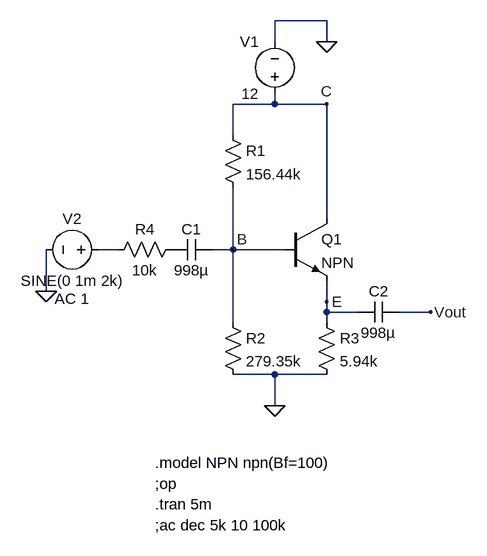
[diagram p0: schematic estagio1.asc]
estagio1.asc, the LTspice schematic file:
Version 4
SHEET 1 880 680
WIRE 224 -192 144 -192
WIRE 144 -160 144 -192
WIRE 224 -160 224 -192
WIRE 144 -64 144 -80
WIRE 144 -64 80 -64
WIRE 224 -64 144 -64
WIRE 80 -16 80 -64
WIRE 224 112 224 -64
WIRE -96 160 -128 160
WIRE 80 160 80 64
WIRE 80 160 48 160
WIRE 160 160 80 160
WIRE -208 224 -208 160
WIRE 224 240 224 208
WIRE 224 256 224 240
WIRE 272 256 224 256
WIRE 384 256 336 256
WIRE 80 272 80 160
WIRE 224 272 224 256
WIRE 144 352 80 352
WIRE 224 352 144 352
WIRE 144 400 144 352
FLAG 224 -160 0
FLAG -208 224 0
FLAG 80 160 B
FLAG 224 240 E
FLAG 224 -64 C
FLAG 144 400 0
FLAG 384 256 Vout
SYMBOL npn 160 112 R0
SYMATTR InstName Q1
SYMBOL res 64 -32 R0
SYMATTR InstName R1
SYMATTR Value 156.44k
SYMBOL res 64 256 R0
SYMATTR InstName R2
SYMATTR Value 279.35k
SYMBOL res 208 256 R0
SYMATTR InstName R3
SYMATTR Value 5.94k
SYMBOL voltage 144 -64 R180
WINDOW 0 24 96 Left 2
WINDOW 3 24 16 Left 2
WINDOW 123 0 0 Left 0
WINDOW 39 0 0 Left 0
SYMATTR InstName V1
SYMATTR Value 12
SYMBOL res 0 144 R90
WINDOW 0 0 56 VBottom 2
WINDOW 3 32 56 VTop 2
SYMATTR InstName R4
SYMATTR Value 10k
SYMBOL voltage -112 160 R90
WINDOW 0 -32 56 VBottom 2
WINDOW 3 32 56 VTop 2
WINDOW 123 60 56 VTop 2
WINDOW 39 0 0 Left 0
SYMATTR InstName V2
SYMATTR Value SINE(0 1m 2k)
SYMATTR Value2 AC 1
SYMBOL cap 48 144 R90
WINDOW 0 0 32 VBottom 2
WINDOW 3 32 32 VTop 2
SYMATTR InstName C1
SYMATTR Value 998µ
SYMBOL cap 336 240 R90
WINDOW 0 0 32 VBottom 2
WINDOW 3 32 32 VTop 2
SYMATTR InstName C2
SYMATTR Value 998µ
TEXT -40 488 Left 2 !.model NPN npn(Bf=100)
TEXT -40 520 Left 2 !;op
TEXT -40 552 Left 2 !.tran 5m
TEXT -40 584 Left 2 !;ac dec 5k 10 100k

The netlist it stands for:
* estagio1.asc
Q1 C B E 0 NPN
R1 C B 156.44k
R2 B 0 279.35k
R3 E 0 5.94k
V1 C 0 12
R4 P001 N001 10k
V2 N001 0 SINE(0 1m 2k) AC 1
C1 B P001 998µ
C2 Vout E 998µ
.model NPN NPN
.model PNP PNP
.lib standard.bjt
.model NPN npn(Bf=100)
;op
.tran 5m
;ac dec 5k 10 100k
.backanno
.end